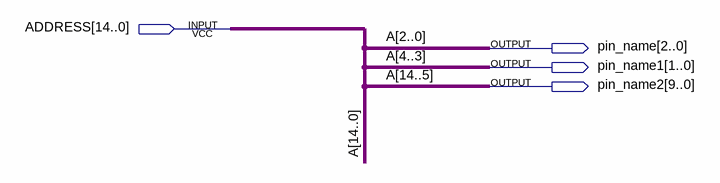
[diagram p0: schematic sheet]
// Quartus schematic MainSchemaSupport.bdf as structural Verilog: 0 symbols, 4 pins
module MainSchemaSupport (
  input  [14:0] ADDRESS,
  output [2:0] pin_name,
  output [1:0] pin_name1,
  output [9:0] pin_name2
);


  assign pin_name = ADDRESS[2:0];
  assign pin_name1 = ADDRESS[4:3];
  assign pin_name2 = ADDRESS[14:5];

  // Other names for the same wires on the sheet: A[14:0] = ADDRESS
endmodule
